# EAGLE design Rocky Switch (EAGLE 7.6.0)
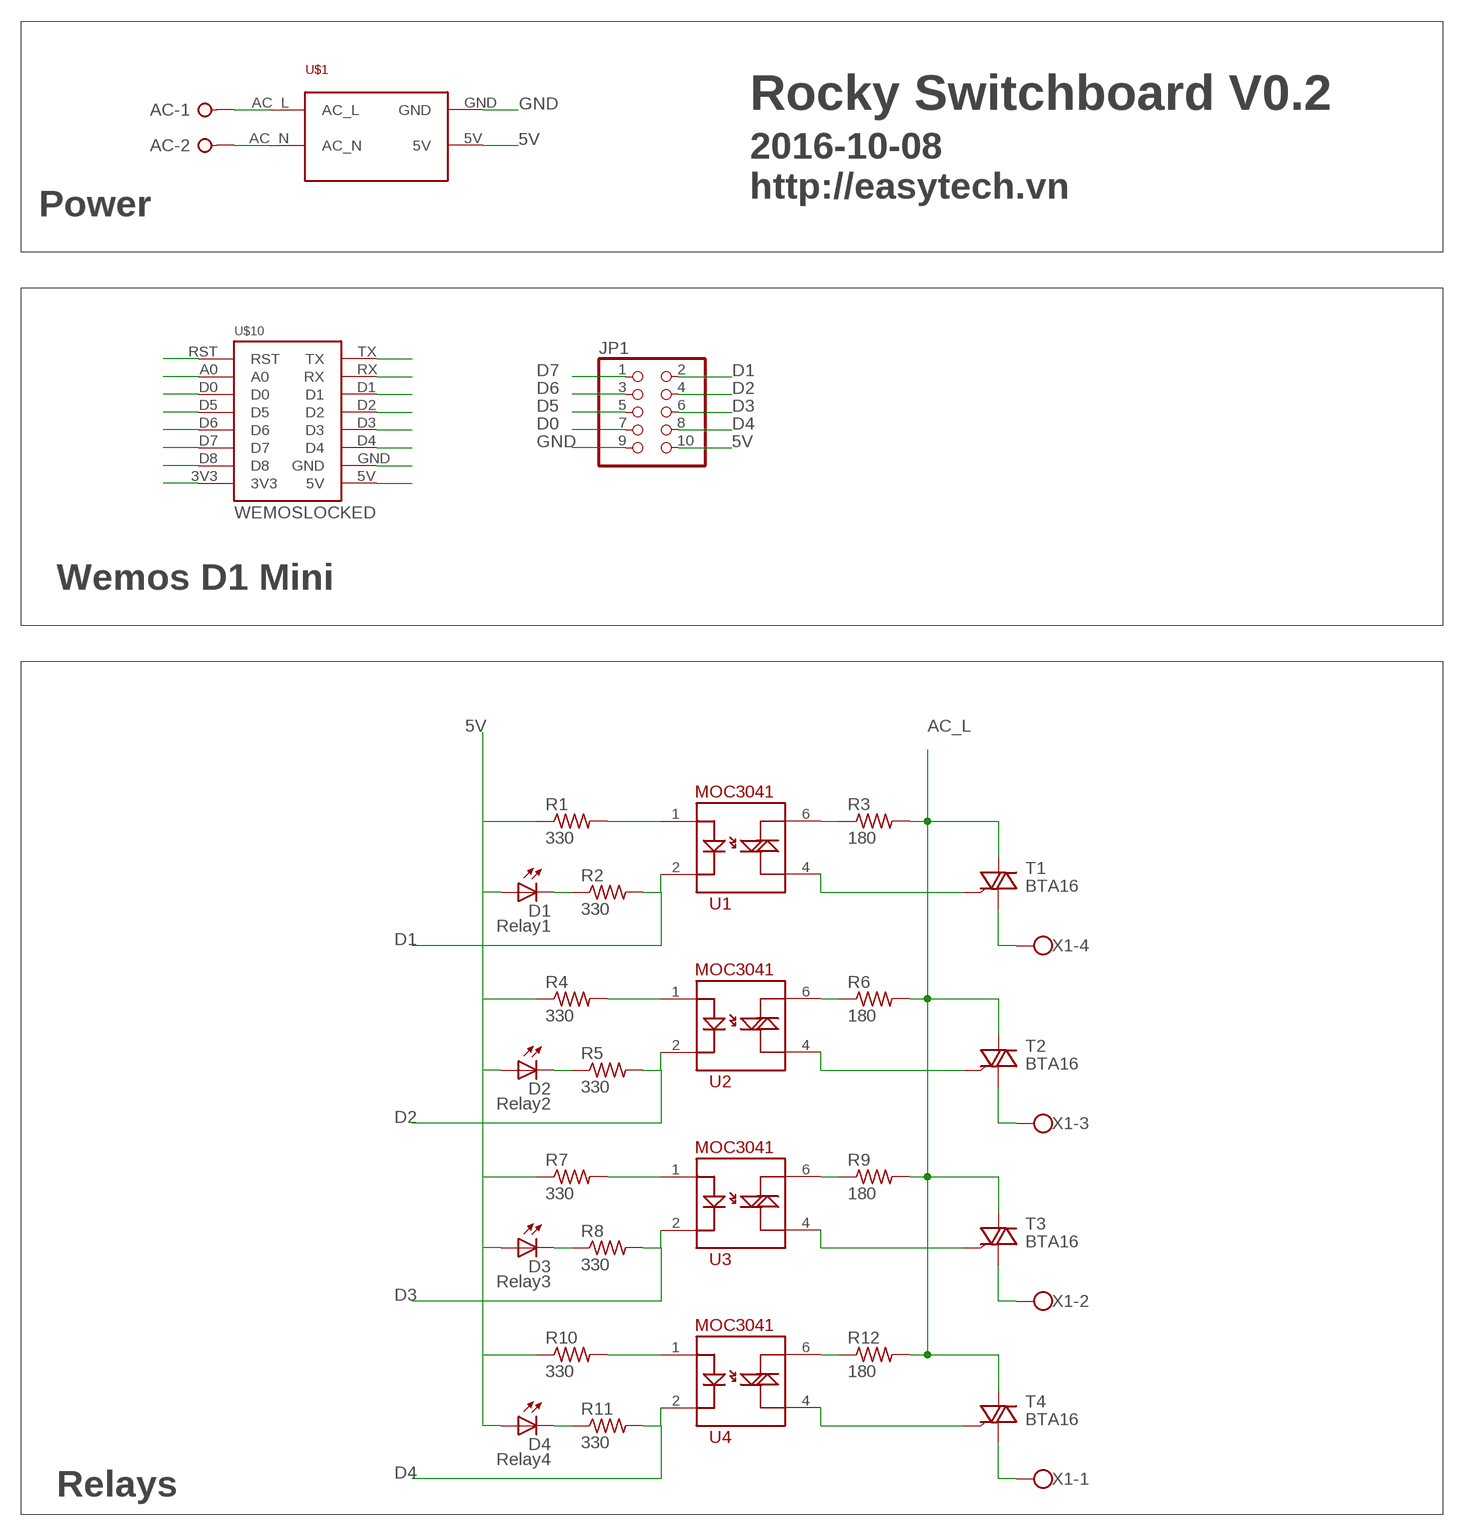
[diagram p0: schematic, sheet 1]

## Parts
AC  W237-02P  [W237-132]
D1  Relay1  LEDCHIP-LED0805  [CHIP-LED0805]
D2  Relay2  LEDCHIP-LED0805  [CHIP-LED0805]
D3  Relay3  LEDCHIP-LED0805  [CHIP-LED0805]
D4  Relay4  LEDCHIP-LED0805  [CHIP-LED0805]
JP1  PINHD-2X5  [2X05]
R1  330  R-US_R0805  [R0805]
R2  330  R-US_R0805  [R0805]
R3  180  R-US_0204/7  [0204/7]
R4  330  R-US_R0805  [R0805]
R5  330  R-US_R0805  [R0805]
R6  180  R-US_0204/7  [0204/7]
R7  330  R-US_R0805  [R0805]
R8  330  R-US_R0805  [R0805]
R9  180  R-US_0204/7  [0204/7]
R10  330  R-US_R0805  [R0805]
R11  330  R-US_R0805  [R0805]
R12  180  R-US_0204/7  [0204/7]
T1  BTA16  BT138-V  [TO220BV]
T2  BTA16  BT138-V  [TO220BV]
T3  BTA16  BT138-V  [TO220BV]
T4  BTA16  BT138-V  [TO220BV]
U1  MOC3041  MOC3031-M  [DIL06]
U2  MOC3041  MOC3031-M  [DIL06]
U3  MOC3041  MOC3031-M  [DIL06]
U4  MOC3041  MOC3031-M  [DIL06]
U$1  POWER_SUPPLY_220VAC_5V  [POWER_SUPPLY_220VAC_5V]
U$10  WEMOSLOCKED  [WEMOS_LOCKED]
X1  W237-4  [W237-4]

## Nets
3V3: U$10.3V3
5V: D1.A D2.A D3.A D4.A JP1.10 R1.1 R4.1 R7.1 R10.1 U$1.5V U$10.5V
A0: U$10.A0
AC_L: AC.1 R3.2 R6.2 R9.2 R12.2 T1.T2(A2) T2.T2(A2) T3.T2(A2) T4.T2(A2) U$1.AC_L
AC_N: AC.2 U$1.AC_N
D0: JP1.7 U$10.D0
D1: JP1.2 R2.2 U1.2 U$10.D1
D2: JP1.4 R5.2 U2.2 U$10.D2
D3: JP1.6 R8.2 U3.2 U$10.D3
D4: JP1.8 R11.2 U4.2 U$10.D4
D5: JP1.5 U$10.D5
D6: JP1.3 U$10.D6
D7: JP1.1 U$10.D7
D8: U$10.D8
GND: JP1.9 U$1.GND U$10.GND
N$9: T1.G U1.4
N$10: R1.2 U1.1
N$14: R3.1 U1.6
N$15: T2.G U2.4
N$16: R4.2 U2.1
N$17: R6.1 U2.6
N$18: T3.G U3.4
N$19: R7.2 U3.1
N$20: R9.1 U3.6
N$21: T3.T1(A1) X1.2
N$22: T2.T1(A1) X1.3
N$23: T1.T1(A1) X1.4
N$28: D1.C R2.1
N$29: D2.C R5.1
N$30: D3.C R8.1
N$32: T4.G U4.4
N$33: R10.2 U4.1
N$34: R12.1 U4.6
N$35: T4.T1(A1) X1.1
N$38: D4.C R11.1
RST1: U$10.RST
RX: U$10.RX
TX: U$10.TX

## Notes on the sheet
- Rocky Switchboard V0.2
- 2016-10-08
  http://easytech.vn
- Power
- Wemos D1 Mini
- Relays

## Library data of the parts
AC = con-wago-508:W237-02P: WAGO SREW CLAMP; OC_FARNELL: unknown; OC_NEWARK: unknown
D1-D4 = adafruit:LED: LED OSRAM: - CHIPLED LG R971, LG N971, LY N971, LG Q971, LY Q971, LO R971, LY R971 LH N974, LH R974 LS Q976, LO Q976, LY Q976 LO Q996 - Hyper CHIPLED LW Q18S LB Q993, LB Q99A, LB R99A - SideLED LS A670, LO A670, LY A670, LG A670, LP A670 LB A673, LV A673, LT A673, LW A673 LH A674 LY A675 LS A676, LA A676, LO A676, LY A676, LW A676 LS A679, LY A679, LG A679 - Hyper Micro SIDELED® LS Y876, LA Y876, LO Y876, LY Y876 LT Y87S - SmartLED LW L88C, LW L88S LB L89C, LB L89S, LG L890 LS L89K, LO L89K, LY L89K LS L896, LA L896, LO L896, LY L896 - TOPLED LS T670, LO T670, LY T670, LG T670, LP T670 LSG T670, LSP T670, LSY T670, LOP T670, LYG T670 LG T671, LOG T671, LSG T671 LB T673, LV T673, LT T673, LW T673 LH T674 LS T676, LA T676, LO T676, LY T676, LB T676, LH T676, LSB T676, LW T676 LB T67C, LV T67C, LT T67C, LS T67K, LO T67K, LY T67K, LW E67C LS E67B, LA E67B, LO E67B, LY E67B, LB E67C, LV E67C, LT E67C LW T67C LS T679, LY T679, LG T679 LS T770, LO T770, LY T770, LG T770, LP T770 LB T773, LV T773, LT T773, LW T773 LH T774 LS E675, LA E675, LY E675, LS T675 LS T776, LA T776, LO T776, LY T776, LB T776 LHGB T686 LT T68C, LB T68C - Hyper Mini TOPLED® LB M676 - Mini TOPLED Santana® LG M470 LS M47K, LO M47K, LY M47K Source: http://www.osram.convergy.de/
JP1 = pinhead:PINHD-2X5: PIN HEADER
R1-R12 = rcl:R-US_: RESISTOR, American symbol
T1-T4 = triac:BT138: TRIAC Source: http://www.semiconductors.philips.com BT138_SERIES_2.pdf
U1-U4 = SparkFun-DiscreteSemi:MOC3031-M: Opto-isolated TRIAC
U$1 = My Eagle Lib:POWER_SUPPLY_220VAC_5V
U$10 = My Eagle Lib:WEMOS
X1 = con-wago-500:W237-4: WAGO SCREW CLAMP; OC_FARNELL: unknown; OC_NEWARK: unknown

## Board
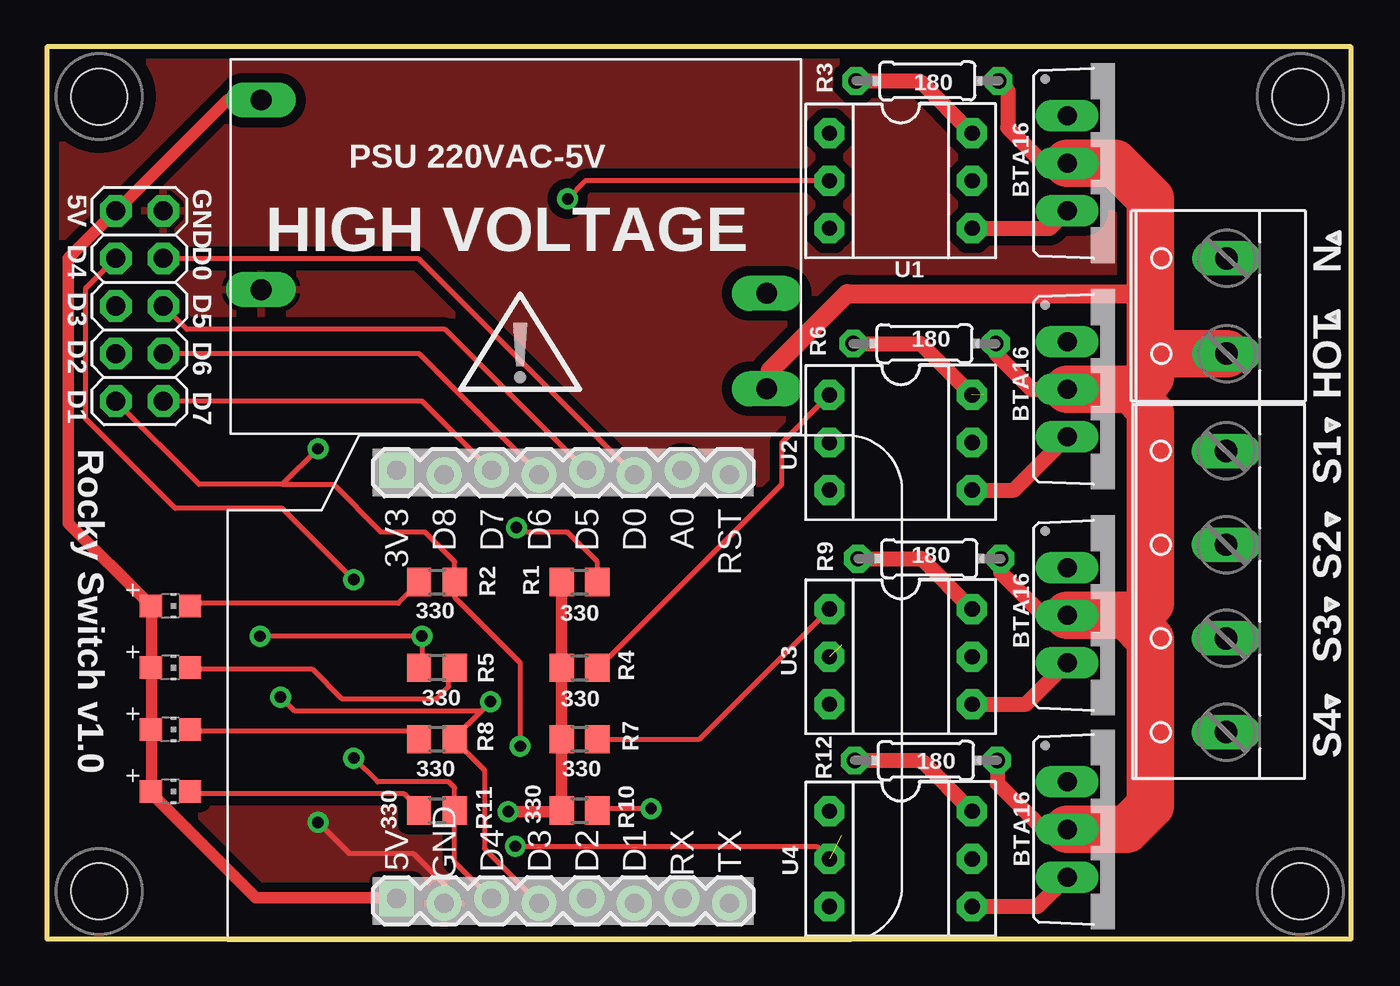
[diagram p1: board, top side]
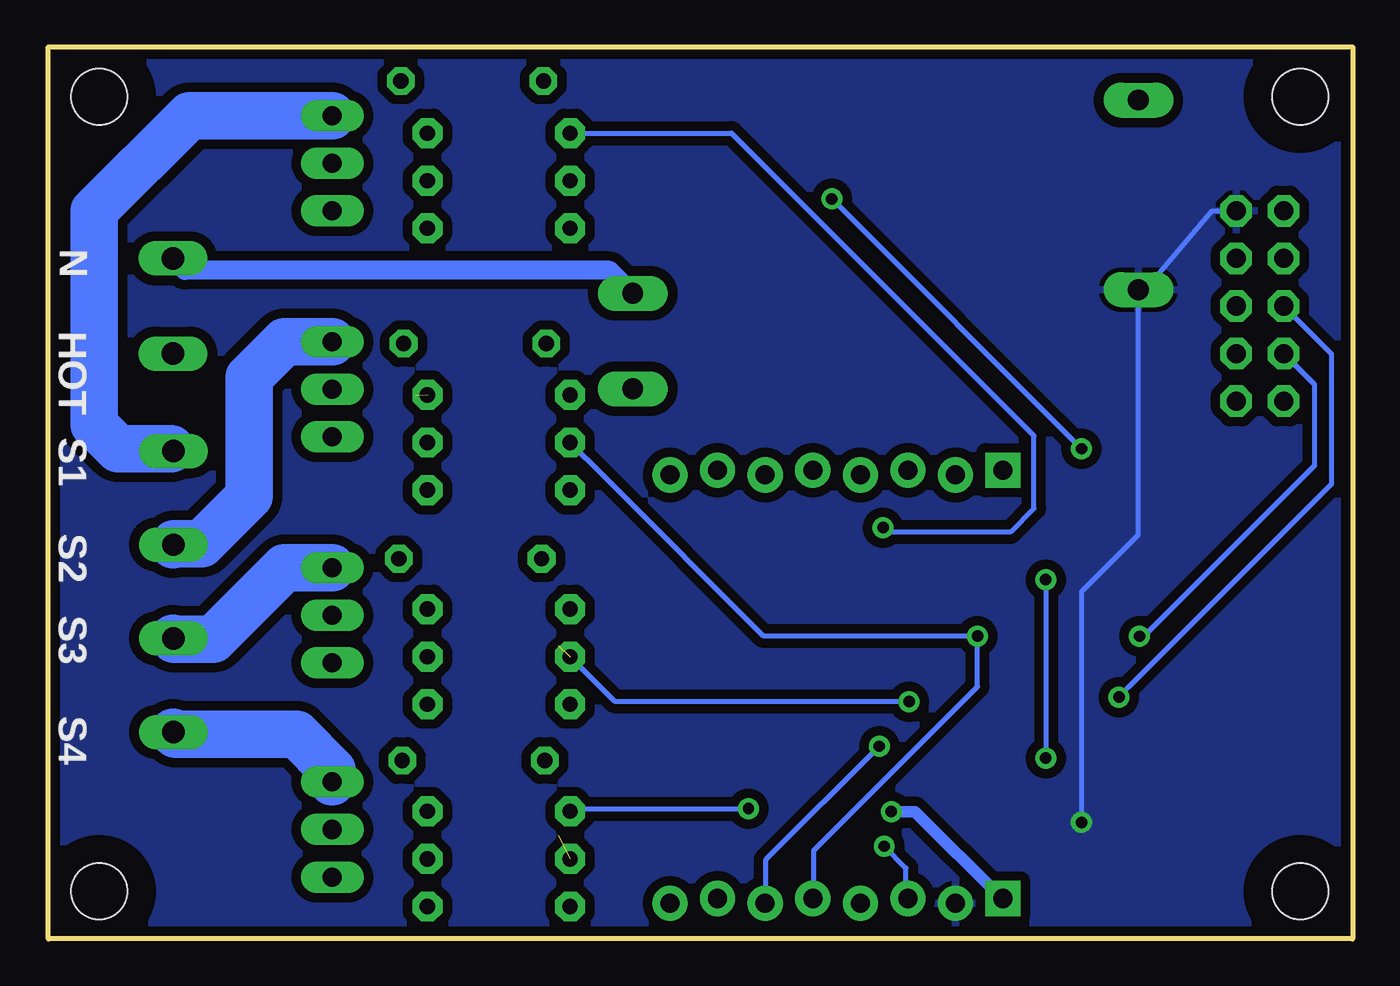
[diagram p2: board, bottom side, seen from below]

Size 69.65 x 47.62 mm. Coordinates in mm from the lower left corner, seen from the top.
Outline: 0,0 69.65,0 69.65,47.62 0,47.62 0,0
Copper layers (1*16): Top 0.035mm / dielectric 1.5mm / Bottom 0.035mm
Design rules "default *": minimum track width 10mil, minimum drill 24mil, track to track 10mil, track to pad 10mil, pad to pad 10mil, via to via 10mil, smd to smd 8mil, copper to edge 20mil, drill to drill 12mil, minimum pad ring 13mil, minimum via ring 10mil, stop-mask expansion 4mil, vias tented up to drill 0mil, thermal gap 10mil

### Footprints (pad centres in the part's own frame; a part is rotated, then mirrored left to right if it is on the bottom)
W237-132 = drill 1.194 long: 1 -2.54,-0.635; 2 2.54,-0.635
CHIP-LED0805 = smd 1.2 x 1.2: A 0,-1.05; C 0,1.05
2X05 = drill 1.016 octagon: 1 -5.08,-1.27; 2 -5.08,1.27; 3 -2.54,-1.27; 4 -2.54,1.27; 5 0,-1.27; 6 0,1.27; 7 2.54,-1.27; 8 2.54,1.27; 9 5.08,-1.27; 10 5.08,1.27
R0805 = smd 1.3 x 1.5: 1 -0.95,0; 2 0.95,0
0204/7 = drill 0.813 octagon: 1 -3.81,0; 2 3.81,0
TO220BV = drill 1.016 long: G 2.54,-2.54; T1 -2.54,-2.54; T2 0,-2.54
DIL06 = drill 0.813 pad 1.6 octagon: 1 -3.51,-3.81; 2 -0.97,-3.81; 3 1.57,-3.81; 4 1.57,3.81; 5 -0.97,3.81; 6 -3.51,3.81
POWER_SUPPLY_220VAC_5V = drill 1.118 pad 1.88 long: 5V 13.2,-7.82; AC_L -13.8,7.6; AC_N -13.8,2.5; GND 13.2,2.3
KFH-M3 = hole 3: 0,0
WEMOS_LOCKED = drill 1.016 pad 1.88 square: 3V3 -0.127,0; 5V 22.733,0 | drill 1.016 pad 1.88: A0 -0.127,15.24; D0 0.127,12.7; D1 22.987,12.7; D2 22.733,10.16; D3 22.987,7.62; D4 22.733,5.08; D5 -0.127,10.16; D6 0.127,7.62; D7 -0.127,5.08; D8 0.127,2.54; GND 22.987,2.54; RST 0.127,17.78; RX 22.733,15.24; TX 22.987,17.78
W237-4 = drill 1.194 long: 1 -7.5,-1.27; 2 -2.5,-1.27; 3 2.5,-1.27; 4 7.5,-1.27

### Placement (x,y rotation side)
AC  62.36,33.78 90 top
D1  6.6,17.78 270 top
D2  6.6,14.48 270 top
D3  6.6,11.18 270 top
D4  6.6,7.87 270 top
JP1  4.95,33.78 90 top
R1  28.45,19.05 0 top
R2  20.83,19.05 0 top
R3  47.02,45.8 0 top
R4  28.45,14.48 0 top
R5  20.83,14.48 180 top
R6  46.86,31.78 0 top
R7  28.45,10.67 0 top
R8  20.83,10.67 0 top
R9  47.12,20.29 0 top
R10  28.45,6.86 0 top
R11  20.83,6.86 0 top
R12  46.94,9.53 0 top
T1  57.02,41.4 270 top
T2  57.02,29.34 270 top
T3  57.02,17.27 270 top
T4  57.02,5.84 270 top
U1  45.59,39.5 270 top
U2  45.59,25.53 270 top
U3  45.59,14.1 270 top
U4  45.59,3.3 270 top
U$1  24.64,36.96 180 top
U$2  [ICON_PIN1_B]  68.99,12.67 180 top
U$6  [KFH-M3]  2.79,2.54 0 top
U$7  [KFH-M3]  66.93,2.54 0 top
U$8  [KFH-M3]  66.93,44.96 0 top
U$9  [KFH-M3]  2.79,44.96 0 top
U$10  18.67,24.89 270 top
U$11  [ICON_PIN1_B]  68.38,37.41 0 top
U$12  [ICON_PIN1_B]  68.33,33.2 0 top
U$13  [ICON_PIN1_B]  68.99,27.43 180 top
U$14  [ICON_PIN1_B]  68.99,22.4 180 top
U$15  [ICON_PIN1_B]  68.94,17.86 180 top
U$17  [ICON_EXL-S]  25.27,31.24 0 top
X1  61.7,18.54 90 top

### Tracks (layer width: path | path; a pad name or v marks a point on that pad's centre or on a via)
5V  (via drill 0.61)
  Top 0.254: 11.3,44.74 U$1.5V | 27.5,6.95 R10.1 27.5,6.79 | 27.5,10.6 R7.1 27.5,10.76 | 27.5,14.42 R4.1 27.5,14.57 | 27.5,19.02 R1.1 | 5.59,7.91 D4.A 5.59,7.75 | 5.59,11.08 D3.A 5.59,11.24 | 5.59,14.57 D2.A 5.59,14.42 | 5.59,17.75 D1.A 5.43,17.91 | 18.61,2.19 U$10.5V | 1.14,22.19 1.14,22.2
  Top 0.61: 27.5,10.6 27.5,6.95 | 27.5,10.76 27.5,14.42 | 27.5,14.57 27.5,19.02 | 5.59,11.08 5.59,7.91 | 5.59,17.75 5.59,14.57 | 5.59,14.42 5.59,11.24 | 18.61,2.19 11.14,2.19 5.59,7.75 | v24.64,6.79 27.5,6.79 | 5.43,17.91 1.14,22.19 | 1.14,22.2 1.14,36.32 JP1.10 3.73,38.86 9.65,44.78 U$1.5V
  Bottom 0.254: 18.76,2.19 U$10.5V
  Bottom 0.61: v24.64,6.79 23.37,6.79 18.76,2.19
AC_L
  Top 0.254: U$1.AC_L 38.45,29.5 38.63,29.36
  Top 0.61: 53.21,41.4 T1.T2 | 53.21,17.27 T3.T2 | 53.21,5.84 T4.T2
  Top 0.813: R6.2 50.67,31.24 52.58,29.34 T2.T2 | R9.2 50.93,19.56 53.21,17.27 | R12.2 50.75,8.31 53.21,5.84 | 53.21,41.4 51.31,43.31 51.31,45.31 R3.2
  Top 1.016: 38.63,29.36 38.63,30.35 42.72,34.44 58.9,34.44 58.93,34.42
  Top 2.184: 58.93,28.07 57.66,29.34 58.29,29.34 | 58.93,17.91 58.29,17.27 T3.T2
  Top 2.54: T2.T2 57.66,29.34 | 58.93,28.07 58.93,17.91 | T3.T2 57.66,17.27 58.93,16 58.93,7.11 57.66,5.84 T4.T2 | T1.T2 57.02,41.4 58.93,39.5 58.93,34.42 58.93,31.24 | 58.29,29.34 58.93,29.97 58.93,31.24 | AC.1 58.93,31.24
AC_N
  Bottom 1.016: AC.2 62.36,35.69 39.67,35.69 U$1.AC_N
D0
  Top 0.254: 31.3,24.89 U$10.D0 19.81,36.32 JP1.7
D1  (via drill 0.61)
  Top 0.254: JP1.2 8.13,24.26 12.57,24.26 | 12.57,24.26 15.3,24.26 17.84,21.72 20.19,21.72 21.78,20.13 R2.2 21.78,18.23 25.27,14.73 v25.27,10.29 | U1.2 28.75,40.47 v27.81,39.5 | 12.57,24.26 v14.48,26.16
  Bottom 0.254: v25.27,10.29 31.34,4.22 31.34,1.93 U$10.D1 | v14.48,26.16 v27.81,39.5
D2  (via drill 0.61)
  Top 0.254: R5.2 20.03,14.57 v20.03,16.16 v11.39,16.16 v11.38,16.15
  Bottom 0.254: U$10.D2 28.77,2.19 28.77,4.73 20.03,13.46 v20.03,16.16 31.45,16.16 39.88,24.59 40.03,24.74 U2.2 | v11.38,16.15 11.15,16.15 2.03,25.27 2.03,29.59 JP1.4
D3  (via drill 0.61)  (1 unrouted)
  Top 0.254: 26.23,2.03 U$10.D3 23.37,4.83 23.37,9.02 21.78,10.6 R8.2 21.78,10.76 23.21,12.19 | 23.21,12.19 v23.69,12.67 | v12.48,12.9 12.5,12.9 13.21,12.19 23.21,12.19
  Bottom 0.254: v23.69,12.67 39.38,12.67 U3.2 | JP1.6 1.12,31.22 1.12,24.26 1.14,24.26 11.94,13.46 v12.48,12.9
D4  (via drill 0.61)  (1 unrouted)
  Top 0.254: U$10.D4 23.69,2.19 21.78,4.1 21.78,6.79 R11.2 21.78,6.95 21.78,8.06 21.46,8.38 17.65,8.38 v16.38,9.65 | JP1.8 2.06,34.7 2.06,27.79 6.86,22.99 12.57,22.99 v16.38,19.18 | v25.01,4.95 41.11,4.95 U4.2
  Bottom 0.254: U$10.D4 23.84,2.19 23.84,3.78 v25.01,4.95 | v16.38,19.18 v16.38,9.65
D5
  Top 0.254: U$10.D5 28.77,25.05 21.94,31.88 21.92,31.88 21.26,32.54 7.47,32.54 JP1.5
D6
  Top 0.254: JP1.3 19.88,31.24 26.23,24.89 U$10.D6
D7
  Top 0.254: JP1.1 20.03,28.7 23.69,25.05 U$10.D7
GND  (via drill 0.61)
  Top 0.254: U$10.GND 21.46,2.16 21.46,2.67 19.56,4.57 16.13,4.57 v14.48,6.22
  Bottom 0.254: v14.48,6.22 14.48,18.54 11.46,21.56 11.46,34.58 U$1.GND 11.06,34.66 7.49,38.86 JP1.9
  pour Bottom (isolate 0.508): -9.65,52.83 93.47,53.34 93.47,-6.35 -9.65,-6.86
  pour Top (isolate 0.508): -9.65,52.83 93.47,53.34 93.47,-6.35 -9.65,-6.86
N$9
  Top 0.61: 54.18,38.56 T1.G
  Top 0.813: U1.4 53.55,37.93 T1.G
N$10  (via drill 0.61)
  Top 0.254: R1.2 29.4,19.18 29.4,20.13 27.81,21.72 25.3,21.72 v25.07,21.95
  Bottom 0.254: U1.1 33.18,43.01 17.02,26.85 17.02,22.99 18.29,21.72 24.84,21.72 v25.07,21.95
N$14
  Top 0.813: R3.1 46.61,45.8 U1.6
N$15
  Top 0.813: U2.4 51.64,23.96 T2.G
N$16
  Top 0.254: R4.2 29.46,14.48 39.24,24.26 39.24,26.5 U2.1
N$17  (1 unrouted)
  Top 0.813: R6.1 46.66,31.78 U2.6
N$18
  Top 0.813: T3.G 52.28,12.53 U3.4
N$19
  Top 0.254: R7.2 34.84,10.67 U3.1
N$20
  Top 0.813: R9.1 46.71,20.3 U3.6
N$21
  Bottom 2.54: T3.T1 57.02,19.81 60.83,16 62.93,16 X1.2
N$22
  Bottom 2.54: T2.T1 57.02,31.88 58.93,29.97 58.93,23.62 61.47,21.08 62.93,21.08 X1.3
N$23
  Bottom 2.184: 63.09,26.16 X1.4
  Bottom 2.54: T1.T1 62.1,43.94 67.18,38.86 67.18,27.43 65.91,26.16 63.09,26.16
N$28
  Top 0.254: D1.C 7.81,17.91 18.76,17.91 19.88,19.02 R2.1
N$29
  Top 0.254: D2.C 7.81,14.42 14.16,14.42 15.75,12.83 20.83,12.83 21.46,13.46 21.46,14.16 R5.1 21.78,14.42
N$30
  Top 0.254: D3.C 7.81,11.08 19.56,11.08 19.88,10.76 R8.1
N$32
  Top 0.813: U4.4 52.91,1.73 T4.G
N$33  (via drill 0.61)
  Top 0.254: v32.26,6.95 29.4,6.95 R10.2
  Bottom 0.254: v32.26,6.95 41.64,6.95 U4.1
N$34
  Top 0.813: R12.1 46.69,9.53 U4.6
N$35
  Bottom 2.54: T4.T1 54.48,9.02 56.39,10.92 62.85,10.92 X1.1
N$38
  Top 0.254: D4.C 7.81,7.75 19.08,7.75 19.88,6.95 R11.1

### Text on the board
tNames: PSU 220VAC-5V | 5V | GND | D4 | D0 | HIGH VOLTAGE | N | D3 | D5 | D2 | D6 | D1 | D7 | HOT | Rocky Switch v1.0 | S1 | S2 | S3 | S4
bNames: N | HOT | S1 | S2 | S3 | S4